# EasyEDA Pro project 15P1D_EDA.eprj, schematic SCH_1

## Sheets
1 P1: Board Name: B1; Create Date: 2024-03-08; Page Name: P1; Project Name: 15P1D_EDA; Schematic Name: SCH; Update Date: 2024-11-08; Company: EDA设计与开发; Page Size: A4; Version: V1.0
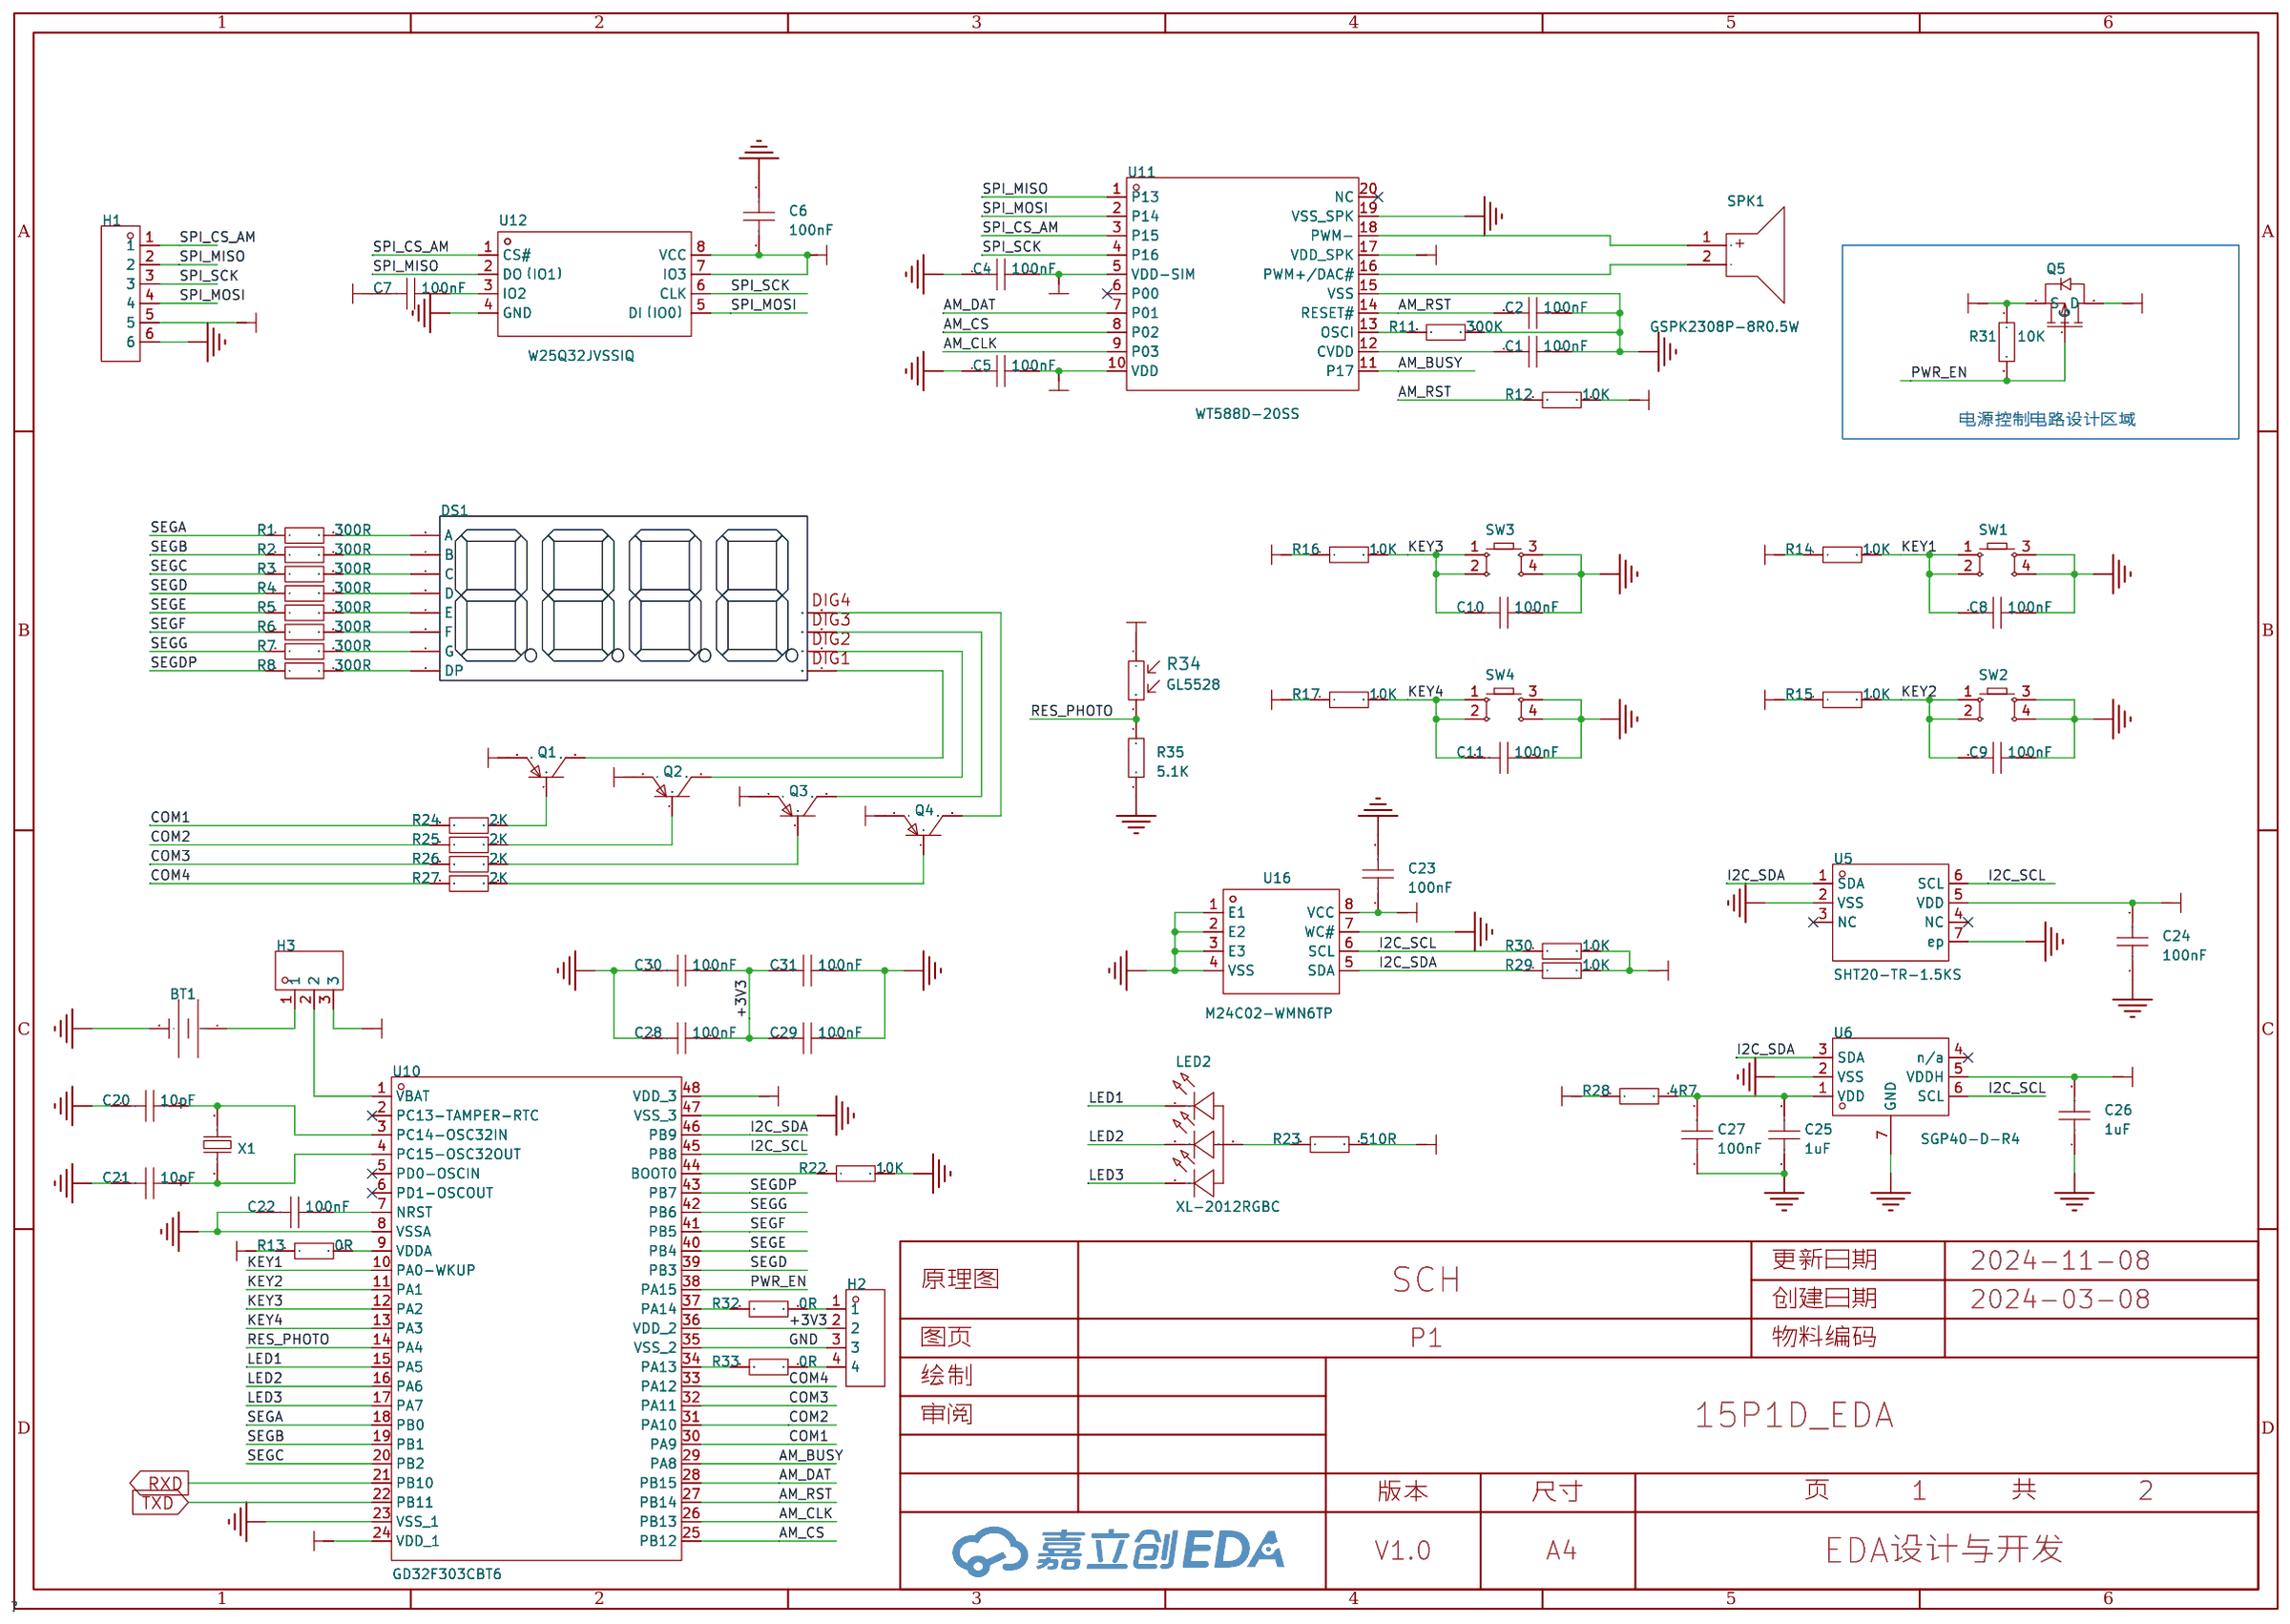
[diagram p2: P1]
2 P2: Create Date: 2024-03-12; Page Name: P2; Update Date: 2024-03-21; Company: 嘉立创EDA
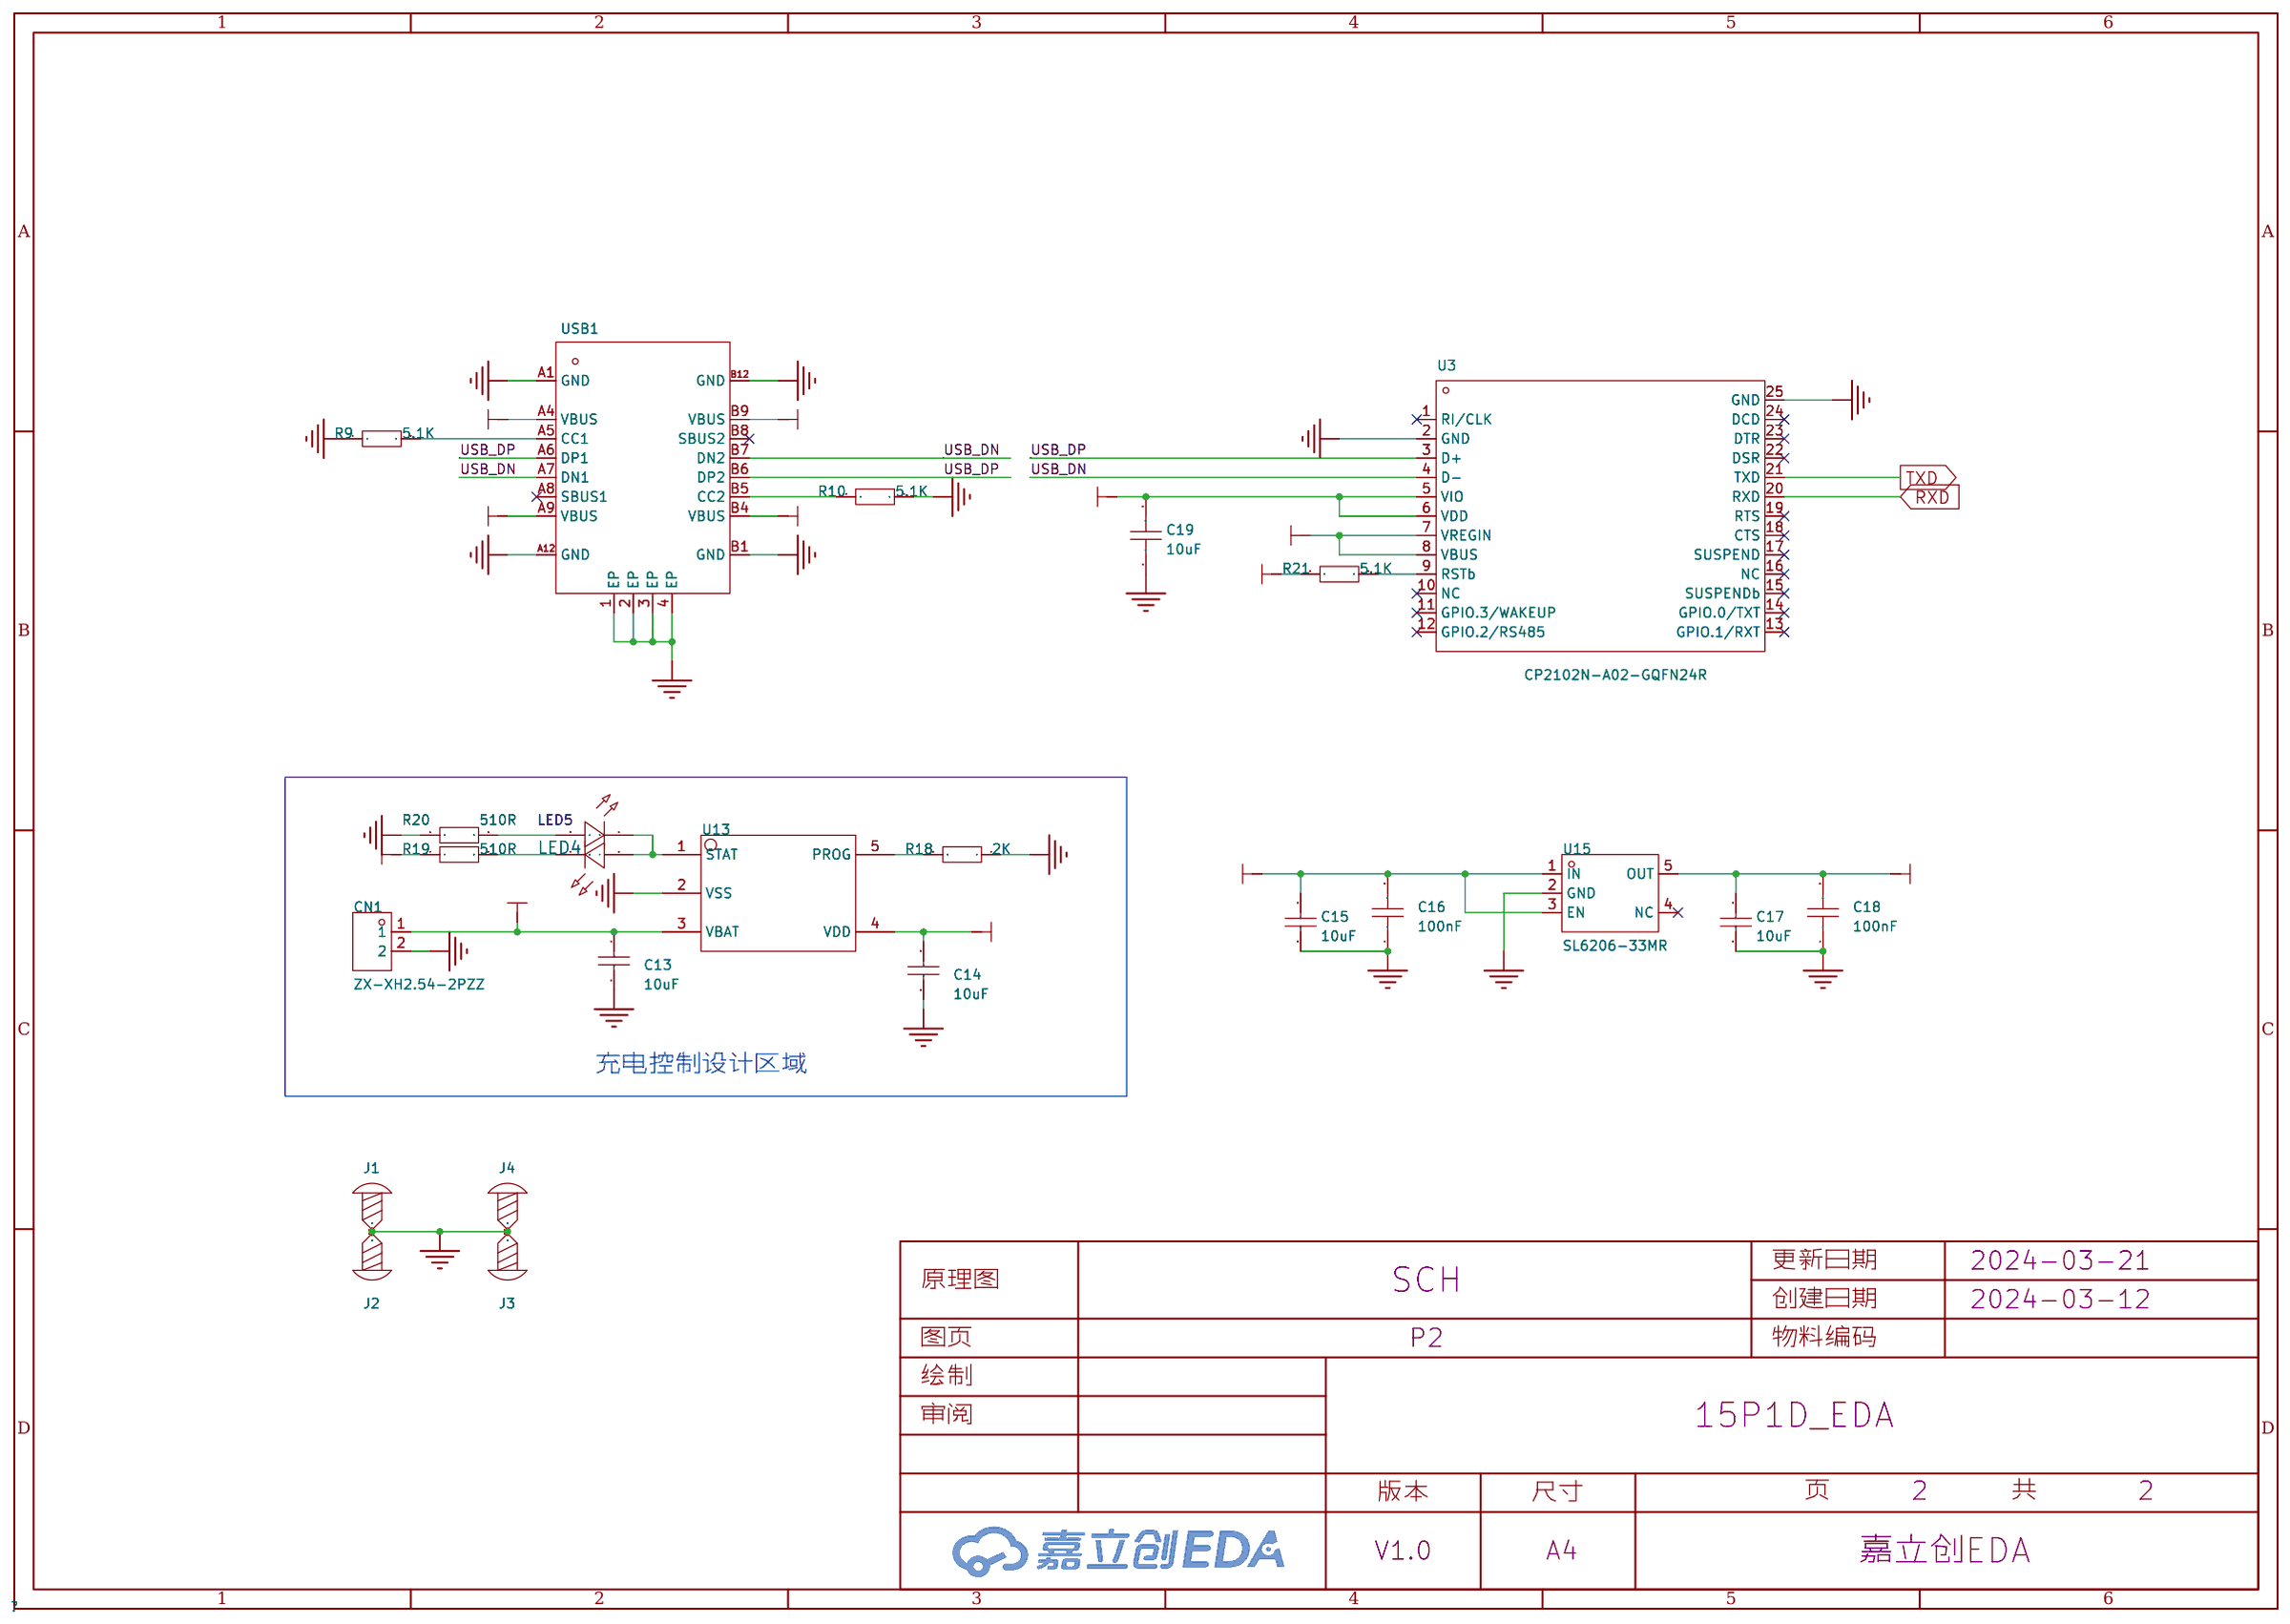
[diagram p3: P2]

## Parts
sheet P1
BT1  BS-12-B3AA003  [BAT-SMD_BS-12-B3AA011]
C1  100nF  [C0805]
C2  100nF  [C0805]
C4  100nF  [C0805]
C5  100nF  [C0805]
C6  100nF  [C0805]
C7  100nF  [C0805]
C8  100nF  [C0805]
C9  100nF  [C0805]
C10  100nF  [C0805]
C11  100nF  [C0805]
C20  10pF  [C0805]
C21  10pF  [C0805]
C22  100nF  [C0805]
C23  100nF  [C0805]
C24  100nF  [C0805]
C25  1uF  [C0805]
C26  1uF  [C0805]
C27  100nF  [C0805]
C28  100nF  [C0805]
C29  100nF  [C0805]
C30  100nF  [C0805]
C31  100nF  [C0805]
DS1  -  [LED-SEG-TH_FJ5461AH]
H1  -  [HDR-TH_6P-P2.54-V-F]
H2  -  [HDR-TH_4P-P2.54-V-F]
H3  Jumper3  [HDR-TH_3P-P2.54-V-M-A]
LED2  XL-2012RGBC  [LED-SMD_4P-L2.0-W1.3-BR]
Q1  -  [S8550P_SOT]
Q2  -  [S8550P_SOT]
Q3  -  [S8550P_SOT]
Q4  -  [S8550P_SOT]
Q5  -  [AO3401A_SOT-23-3]
R1  300R  [R0805]
R2  300R  [R0805]
R3  300R  [R0805]
R4  300R  [R0805]
R5  300R  [R0805]
R6  300R  [R0805]
R7  300R  [R0805]
R8  300R  [R0805]
R11  300K  [R0805]
R12  10K  [R0805]
R13  0R  [R0805]
R14  10K  [R0805]
R15  10K  [R0805]
R16  10K  [R0805]
R17  10K  [R0805]
R22  10K  [R0805]
R23  510R  [R0805]
R24  2K  [R0805]
R25  2K  [R0805]
R26  2K  [R0805]
R27  2K  [R0805]
R28  4R7  [R0805]
R29  10K  [R0805]
R30  10K  [R0805]
R31  10K  [R0805]
R32  0R  [R0805]
R33  0R  [R0805]
R34  GL5528  [RES-TH_L5.1-W4.3-P3.40-D0.5]
R35  5.1K  [R0805]
SPK1  GSPK2308P-8R0.5W  [SPK-TH_BD23.0-P10.00-D0.8-L-RD]
SW1  -  [Key_SMD_12x12x7.3]
SW2  -  [Key_SMD_12x12x7.3]
SW3  -  [Key_SMD_12x12x7.3]
SW4  -  [Key_SMD_12x12x7.3]
U5  SHT20-TR-1.5KS  [DFN-6_L3.0-W3.0-P0.95-TR-EP]
U6  SGP40-D-R4  [DFN-6_L2.4-W2.4-P0.80-TL-EP]
U10  GD32F303CBT6  [LQFP-48_L7.0-W7.0-P0.50-LS9.0-BL]
U11  WT588D-20SS  [SSOP-20_L7.2-W5.3-P0.65-LS7.8-BL]
U12  W25Q32JVSSIQ  [SOIC-8_L5.3-W5.3-P1.27-LS8.0-BL]
U16  M24C02-WMN6TP  [SOIC-8_L4.9-W3.9-P1.27-LS6.0-BL]
X1  32.768kHz  [FC-135R_L3.2-W1.5]
sheet P2
C13  10uF  [C1206]
C14  10uF  [C1206]
C15  10uF  [C1206]
C16  100nF  [C0805]
C17  10uF  [C1206]
C18  100nF  [C0805]
C19  10uF  [C0805]
CN1  ZX-XH2.54-2PZZ  [CONN-TH_2P-P2.50_HX25003-2A]
J1  -  [M2螺丝]
J2  -  [M2螺丝]
J3  -  [M2螺丝]
J4  -  [M2螺丝]
LED4  -  [LED_0805]
LED5  -  [LED_0805]
R9  5.1K  [R0805]
R10  5.1K  [R0805]
R18  2K  [R0805]
R19  510R  [R0805]
R20  510R  [R0805]
R21  5.1K  [R0805]
U3  CP2102N-A02-GQFN24R  [QFN-24_L4.0-W4.0-P0.50-TL-EP2.6]
U13  -  [SOP_BCON]
U15  SL6206-33MR  [SOT-23-5_L2.9-W1.6-P0.95-LS2.8-BL]
USB1  -  [USB_TYPE-C-16P]

## Library data of the parts
BT1 = BS-12-B3AA003: 连接器类型:电池底座;适用电池规格:CR1220;工作温度范围:-25℃~+85℃;; Supplier Part: C964723; Manufacturer: MYOUNG(美阳); Supplier Footprint: SMD; JLCPCB Part Class: 扩展库; Datasheet: https://atta.szlcsc.com/upload/public/pdf/source/20201218/C964723_733B638E287393F86295A2A4DAE43C75.pdf; Supplier: LCSC; Connector Type: 电池底座; Battery Type: CR1220; Operating Temperature Range: -25℃~+85℃
C1 C2 C4-C11 C16 C18-C31 = CAP_0805: Supplier Footprint: 0805
DS1 = LED_SEG_TH_0.56x4: Supplier Footprint: 插件
H1 = HDR-F_2.54_1x6P: Supplier Part: C40877; Supplier Footprint: 插件
H2 = HDR-F_2.54_1x4P: Supplier Part: C2718488; Supplier Footprint: 插件
H3 = Jumper3: Supplier Part: C2940050; Supplier Footprint: HDR-TH-3P-2.54mm; JLCPCB Part Class: 扩展库; Supplier: LCSC
LED2 = XL-2012RGBC: 发光颜色:RGB三色;功率:80mW；80mW；55mW;正向电流:25mA;主波长:619nm~624nm；463nm~466nm；524nm~527nm;二极管配置:-;透镜颜色:无色透明透镜;色温:-;发光角度:120°;载带方式:正贴;工作温度:-30℃~+85℃;; Supplier Part: C965848; Manufacturer: XINGLIGHT(成兴光); Supplier Footprint: 0805; JLCPCB Part Class: 扩展库; Datasheet: https://atta.szlcsc.com/upload/public/pdf/source/20221102/35E310354F68AE1BCFC07B93F5E395D6.pdf; Supplier: LCSC; Emitted Color: RGB三色; Power Dissipation: 80mW；80mW；55mW; Forward Current: 25mA; Dominant Wavelength: 619nm~624nm；463nm~466nm；524nm~527nm; Peak Wavelength: 624nm；528nm；469nm; Lens Color: 无色透明透镜; Viewing Angle: 120°; Mounting Sytle: 正贴; Operating Temperature: -30℃~+85℃
Q1-Q4 = S8550_SOT_PNP: Supplier Footprint: SOT-23
Q5 = AO3401A_P: Supplier Footprint: SOT-23-3L; Supplier Part: C15127
R1-R33 R35 = Res_0805: Supplier Footprint: 0805
R34 = GL5528: 暗电阻:1MΩ;亮电阻 @ 10Lux:8kΩ~20kΩ;光谱峰值(波长):540nm;; LCSC Part Name: 亮电阻:8kΩ~20kΩ 暗电阻:1MΩ; Supplier Part: C125627; Manufacturer: 森霸; Supplier Footprint: 插件,P=3mm; JLCPCB Part Class: 扩展库; Datasheet: https://atta.szlcsc.com/upload/public/pdf/source/20230427/842A99E3D53A83729D7968886D4EFCBB.pdf; Supplier: LCSC; Dark Resistance: 1MΩ; Illuminated Resistance @ 10Lux: 8kΩ~20kΩ; Applied Voltage: 150V; Spectral Peak: 540nm
SPK1 = GSPK2308P-8R0.5W: Supplier Part: C530532; Manufacturer: INGHAi(赢海); JLCPCB Part Class: 扩展库; Datasheet: https://atta.szlcsc.com/upload/public/pdf/source/20200723/C530532_3DB1F973601B36F20FBCCA52751811A3.pdf; Supplier: LCSC
SW1-SW4 = Key_SMD_12x12x7.3: Supplier Footprint: SMD
U5 = SHT20-TR-1.5KS: 接口类型:I2C;; LCSC Part Name: 1-100706-01; Supplier Part: C53865; Manufacturer: Sensirion(瑞士盛思锐); Supplier Footprint: DFN-6-EP(3x3); JLCPCB Part Class: 扩展库; Datasheet: https://atta.szlcsc.com/upload/public/pdf/source/20151012/1457707445424.pdf; Supplier: LCSC; Interface Type: I2C; Supply Voltage: 2.1V~3.6V
U6 = SGP40-D-R4: 气体类型:空气质量;精度:-;; LCSC Part Name: 3.000.384; Supplier Part: C2874215; Manufacturer: Sensirion(瑞士盛思锐); Supplier Footprint: DFN-6-EP(2.4x2.4); JLCPCB Part Class: 扩展库; Datasheet: https://atta.szlcsc.com/upload/public/pdf/source/20231011/67A6038984BE66B07B1FF2325C50691F.pdf; Supplier: LCSC; Type: 空气质量; Operating Temperature: -10℃~+50℃
U10 = GD32F303CBT6_C3013779: CPU内核:CM4;程序存储容量:128KB;RAM总容量:32KB;GPIO端口数量:37;工作电压范围:-;CPU最大主频:120MHz;程序存储器类型:FLASH;; Supplier Part: C3013779; Manufacturer: GigaDevice(兆易创新); Supplier Footprint: LQFP-48(7x7); JLCPCB Part Class: 扩展库; Datasheet: https://atta.szlcsc.com/upload/public/pdf/source/20220624/E1A57ED816B162D6D1424864911A792F.pdf; Supplier: LCSC; CPU Core: CM4; Program Storage Size: 128KB; RAM Size: 32KB; GPIO Ports Number: 37; CPU Maximum Speed: 120MHz; Program Memory Type: FLASH; ADC (Bit): 12bit; DAC (Bit): 12bit; 16Bit Timer: 7; CAN: 1; UART/USART: 3; I2C: 2; I2S: 2; SPI: 3; Peripheral/Function: 看门狗；RTC实时时钟; Watchdog: 有; Real-Time Clock: 有
U11 = WT588D-20SS: 高品质语音芯片; Supplier Part: C87498; Manufacturer: WT(唯创知音); Supplier Footprint: SSOP-20-208mil; JLCPCB Part Class: 扩展库; Datasheet: https://atta.szlcsc.com/upload/public/pdf/source/20161217/1481939141189.pdf; Supplier: LCSC
U12 = W25Q32JVSSIQ_C82344: 接口类型:SPI;存储容量:32Mbit;; Supplier Part: C82344; Manufacturer: WINBOND(华邦); Supplier Footprint: SOIC-8-208mil; JLCPCB Part Class: 扩展库; Datasheet: https://atta.szlcsc.com/upload/public/pdf/source/20160910/1473490310454.pdf; Supplier: LCSC; Interface Type: SPI; Memory Size: 32Mbit; Supply Voltage: 2.7V~3.6V; Page Programming Time (Tpp): 3ms; Operating Temperature: -40℃~+85℃
U16 = M24C02-WMN6TP: 接口类型:I2C;存储容量:2Kbit;; Supplier Part: C7562; Manufacturer: ST(意法半导体); Supplier Footprint: SOIC-8; JLCPCB Part Class: Extended Part; Datasheet: https://atta.szlcsc.com/upload/public/pdf/source/20140724/1457707167301.pdf; Supplier: LCSC; Interface Type: I2C; Memory Size: 2Kbit; Supply Voltage: 2.5V~5.5V; Operating Temperature: -40℃~+85℃
X1 = Q13FC13500004_C32346: 晶振类型:贴片晶振;频率:32.768kHz;常温频差:±20ppm;外接负载电容:12.5pF;; LCSC Part Name: 32.768kHz ±20ppm 12.5pF; Supplier Part: C32346; Manufacturer: EPSON(爱普生); Manufacturer Part: Q13FC13500004; Supplier Footprint: SMD3215-2P; JLCPCB Part Class: 基础库; Datasheet: https://atta.szlcsc.com/upload/public/pdf/source/20190108/C32346_746D6B07EAF90824457A96480007685F.pdf; Supplier: LCSC; Crystal Type: 贴片晶振; Normal temperature Frequency Tolerance: ±20ppm; External load capacitor: 12.5pF; Equivalent Series Resistance (ESR): 70kΩ; Operating Temperature: -40℃~+85℃
C13-C15 C17 = CL31A106KBHNNNE: 容值:10uF;精度:±10%;额定电压:50V;材质(温度系数):X5R;; LCSC Part Name: 10uF ±10% 50V; Supplier Part: C13585; Manufacturer: SAMSUNG(三星); Supplier Footprint: 1206; JLCPCB Part Class: 基础库; Datasheet: https://atta.szlcsc.com/upload/public/pdf/source/20160218/1457707763339.pdf; Supplier: LCSC; Tolerance: ±10%; Voltage Rated: 50V; Temperature Coefficient: X5R
CN1 = ZX-XH2.54-2PZZ: 插针结构:1x2P;间距:2.54mm;安装方式:直插;参考系列:XH;总PIN数:2P;排数:1;每排PIN数:2;行距:-;额定电流:3A;触头材质:黄铜;触头镀层:锡;工作温度范围:-25℃~+85℃;; Supplier Part: C7429632; Manufacturer: Megastar(兆星); Supplier Footprint: 插件,P=2.54mm; JLCPCB Part Class: 扩展库; Datasheet: https://atta.szlcsc.com/upload/public/pdf/source/20230619/19BA6947230AA44A04D3EDD65E618FD0.pdf; Supplier: LCSC; Pins Structure: 1x2P; Pitch: 2.54mm; Mounting Style: 直插; Reference Series: XH; Number of Pins: 2P; Number of Rows: 1; Number of PINs Per Row: 2; Current Rating (Max): 3A; Contact Material: 黄铜; Contact Plating: 锡; Operating Temperature Range: -25℃~+85℃
J1-J4 = M2螺丝: Supplier Footprint: 插件
LED4 = LED_0805-R: Supplier Footprint: 0805
LED5 = LED_0805-G: Supplier Footprint: 0805
U3 = CP2102N-A02-GQFN24R: 应用功能:USB转UART;接口协议:UART;; Supplier Part: C969151; Manufacturer: SKYWORKS/SILICON LABS(芯科); Supplier Footprint: QFN-24-EP(4x4); JLCPCB Part Class: 扩展库; Datasheet: https://atta.szlcsc.com/upload/public/pdf/source/20201204/C964632_F2B790CC23A72455AEF523510305B30A.pdf; Supplier: LCSC; Applications Function: USB转UART; Protocol: UART; Supply Voltage: 3V~3.6V; Operating Temperature: -40℃~+85℃@(Ta)
U13 = BCON
U15 = SL6206-33MR: 输出类型:-;; Supplier Part: C707122; Manufacturer: Slkor(萨科微); Supplier Footprint: SOT-23-5; JLCPCB Part Class: 扩展库; Datasheet: https://atta.szlcsc.com/upload/public/pdf/source/20200721/C707121_33633D17E61D5DC97F22208BE63A0FB1.pdf; Supplier: LCSC
USB1 = USB_TYPE-C-16P: Supplier Footprint: SMD

## Nets
+3V3: C4.2 C5.2 C6.2 C7.1 C17.2 C18.2 C19.2 C23.1 C28.1 C29.2 C30.1 C31.2 H1.5 H2.2 H3.3 Q1.2(E) Q2.2(E) Q3.2(E) Q4.2(E) Q5.2(S) R12.2 R13.1 R14.1 R15.1 R16.1 R17.1 R21.2 R23.2 R29.2 R30.2 R31.1 R34.1 U3.5(VIO) U3.6(VDD) U10.24(VDD_1) U10.36(VDD_2) U10.48(VDD_3) U11.5(VDD-SIM) U11.10(VDD) U11.17(VDD_SPK) U12.7(IO3) U12.8(VCC) U15.5(OUT) U16.8(VCC)
GND: BT1.2(-) C1.2 C2.2 C4.1 C5.1 C6.1 C8.2 C9.2 C10.2 C11.2 C13.2 C14.1 C15.1 C16.1 C17.1 C18.1 C19.1 C20.1 C21.1 C22.1 C23.2 C24.1 C25.1 C26.1 C27.1 C28.2 C29.1 C30.2 C31.1 CN1.2 H1.6 H2.3 J1.1 J2.1 J3.1 J4.1 R9.1 R10.1 R11.2 R18.1 R20.1 R22.2 R35.2 SW1.3 SW1.4 SW2.3 SW2.4 SW3.3 SW3.4 SW4.3 SW4.4 U3.2(GND) U3.25(GND) U5.2(VSS) U5.7(ep) U6.2(VSS) U6.7(GND) U10.8(VSSA) U10.23(VSS_1) U10.35(VSS_2) U10.47(VSS_3) U11.15(VSS) U11.19(VSS_SPK) U12.4(GND) U13.2(VSS) U15.2(GND) U16.1(E1) U16.2(E2) U16.3(E3) U16.4(VSS) U16.7(WC#) USB1.1(EP) USB1.2(EP) USB1.3(EP) USB1.4(EP) USB1.A1(GND) USB1.A12(GND) USB1.B1(GND) USB1.B12(GND)
VBAT: C13.1 C15.2 C16.2 CN1.1 U13.3(VBAT) U15.1(IN) U15.3(EN)
VBUS: C14.2 R19.1 U3.7(VREGIN) U3.8(VBUS) U13.4(VDD) USB1.A4(VBUS) USB1.A9(VBUS) USB1.B4(VBUS) USB1.B9(VBUS)
+VS: C24.2 C26.2 Q5.3(D) R28.1 U5.5(VDD) U6.5(VDDH)
AM_BUSY: U10.29(PA8) U11.11(P17)
AM_CLK: U10.26(PB13) U11.9(P03)
AM_CS: U10.25(PB12) U11.8(P02)
AM_DAT: U10.28(PB15) U11.7(P01)
AM_RST: C2.1 R12.1 U10.27(PB14) U11.14(RESET#)
COM1: R24.1 U10.30(PA9)
COM2: R25.1 U10.31(PA10)
COM3: R26.1 U10.32(PA11)
COM4: R27.1 U10.33(PA12)
I2C_SCL: R30.1 U5.6(SCL) U6.6(SCL) U10.45(PB8) U16.6(SCL)
I2C_SDA: R29.1 U5.1(SDA) U6.3(SDA) U10.46(PB9) U16.5(SDA)
KEY1: C8.1 R14.2 SW1.1 SW1.2 U10.10(PA0-WKUP)
KEY2: C9.1 R15.2 SW2.1 SW2.2 U10.11(PA1)
KEY3: C10.1 R16.2 SW3.1 SW3.2 U10.12(PA2)
KEY4: C11.1 R17.2 SW4.1 SW4.2 U10.13(PA3)
LED1: LED2.1 U10.15(PA5)
LED2: LED2.2 U10.16(PA6)
LED3: LED2.4 U10.17(PA7)
PWR_EN: Q5.1(G) R31.2 U10.38(PA15)
RES_PHOTO: R34.2 R35.1 U10.14(PA4)
RXD: U3.20(RXD) U10.21(PB10)
SEGA: R1.1 U10.18(PB0)
SEGB: R2.1 U10.19(PB1)
SEGC: R3.1 U10.20(PB2)
SEGD: R4.1 U10.39(PB3)
SEGDP: R8.1 U10.43(PB7)
SEGE: R5.1 U10.40(PB4)
SEGF: R6.1 U10.41(PB5)
SEGG: R7.1 U10.42(PB6)
SPI_CS_AM: H1.1 U11.3(P15) U12.1(CS#)
SPI_MISO: H1.2 U11.1(P13) U12.2(DO（IO1）)
SPI_MOSI: H1.4 U11.2(P14) U12.5(DI（IO0）)
SPI_SCK: H1.3 U11.4(P16) U12.6(CLK)
TXD: U3.21(TXD) U10.22(PB11)
USB_DN: U3.4(D-) USB1.A7(DN1) USB1.B7(DN2)
USB_DP: U3.3(D+) USB1.A6(DP1) USB1.B6(DP2)
$1N1449: DS1.8(DIG3) Q3.3(C)
$1N1467: DS1.1(E) R5.2
$1N1471: DS1.2(D) R4.2
$1N1475: DS1.3(DP) R8.2
$1N1479: DS1.4(C) R3.2
$1N1483: DS1.5(G) R7.2
$1N1487: DS1.11(A) R1.2
$1N1491: DS1.7(B) R2.2
$1N1495: DS1.10(F) R6.2
$1N6161: C1.1 U11.12(CVDD)
$1N6192: R11.1 U11.13(OSCI)
$1N6375: SPK1.1(+) U11.18(PWM-)
$1N6384: SPK1.2(-) U11.16(PWM+/DAC#)
$1N6917: C7.2 U12.3(IO2)
$1N7212: R13.2 U10.9(VDDA)
$1N7925: C20.2 U10.3(PC14-OSC32IN) X1.1
$1N7930: C21.2 U10.4(PC15-OSC32OUT) X1.2
$1N8028: R22.1 U10.44(BOOT0)
$1N8104: LED2.3 R23.1
$1N8256: DS1.12(DIG1) Q1.3(C)
$1N8335: DS1.9(DIG2) Q2.3(C)
$1N8343: DS1.6(DIG4) Q4.3(C)
$1N8477: Q1.1(B) R24.2
$1N8481: Q2.1(B) R25.2
$1N8485: Q3.1(B) R26.2
$1N8489: Q4.1(B) R27.2
$1N8598: C22.2 U10.7(NRST)
$1N9384: C25.2 C27.2 R28.2 U6.1(VDD)
$1N9794: R32.1 U10.37(PA14)
$1N9795: H2.1 R32.2
$1N9824: R33.1 U10.34(PA13)
$1N9825: H2.4 R33.2
$1N10132: BT1.1(+) H3.1
$1N10135: H3.2 U10.1(VBAT)
$2N394: R9.2 USB1.A5(CC1)
$2N397: R10.2 USB1.B5(CC2)
$2N1836: R21.1 U3.9(RSTb)
$2N7002: LED4.2(A) LED5.1(C) U13.1(STAT)
$2N7018: LED5.2(A) R20.2
$2N7022: LED4.1(C) R19.2
$2N7090: R18.2 U13.5(PROG)

Not connected (* = marked no-connect by the designer): U3 1(RI/CLK)* 10(NC)* 11(GPIO.3/WAKEUP)* 12(GPIO.2/RS485)* 13(GPIO.1/RXT)* 14(GPIO.0/TXT)* 15(SUSPENDb)* 16(NC)* 17(SUSPEND)* 18(CTS)* 19(RTS)* 22(DSR)* 23(DTR)* 24(DCD)*; U5 3(NC)* 4(NC)*; U6 4(n/a)*; U10 2(PC13-TAMPER-RTC)* 5(PD0-OSCIN)* 6(PD1-OSCOUT)*; U11 6(P00)* 20(NC)*; U15 4(NC)*; USB1 A8(SBUS1)* B8(SBUS2)*

## Notes on the sheets
sheet 1
- 电源控制电路设计区域
sheet 2
- 充电控制设计区域
